# EAGLE design brmbora8 (EAGLE 6.2)
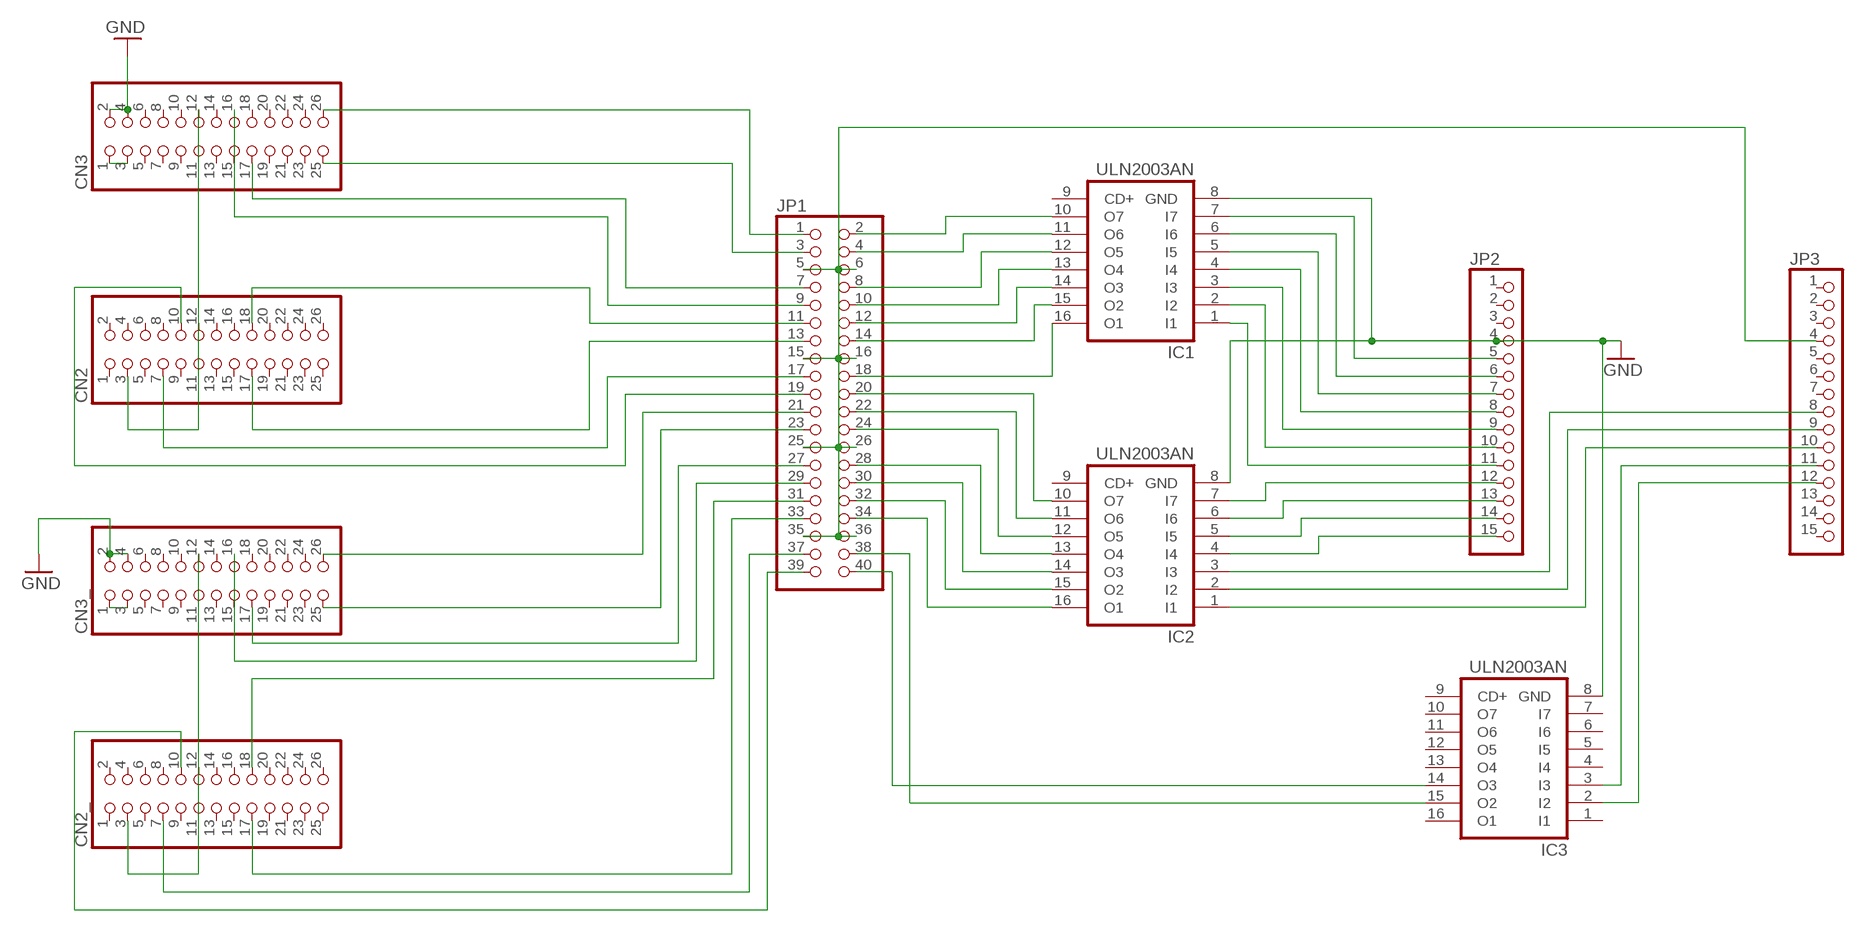
[diagram p0: schematic, sheet 1]

## Parts
CN2  PINHD-2X13  [2X13]
CN2_  PINHD-2X13  [2X13]
CN3  PINHD-2X13  [2X13]
CN3_  PINHD-2X13  [2X13]
IC1  ULN2003AN  [DIL16]
IC2  ULN2003AN  [DIL16]
IC3  ULN2003AN  [DIL16]
JP1  PINHD-2X20-BIG  [2X20-BIG]
JP2  PINHD-1X15  [1X15]
JP3  PINHD-1X15  [1X15]

## Nets
CN3_: CN3_.1 CN3_.3
GND: CN3.2 CN3.4 CN3_.2 CN3_.4 IC1.8(GND) IC2.8(GND) IC3.8(GND) JP2.4
N$1: IC1.13(O4) JP1.10
N$2: IC1.7(I7) JP2.5
N$3: IC1.6(I6) JP2.6
N$4: IC1.5(I5) JP2.7
N$5: IC1.4(I4) JP2.8
N$6: IC1.3(I3) JP2.9
N$7: IC1.2(I2) JP2.10
N$8: IC1.1(I1) JP2.11
N$9: IC2.7(I7) JP2.12
N$10: IC2.6(I6) JP2.13
N$11: IC2.5(I5) JP2.14
N$12: IC2.4(I4) JP2.15
N$13: IC2.1(I1) JP3.10
N$14: IC2.2(I2) JP3.9
N$15: IC2.3(I3) JP3.8
N$19: IC3.3(I3) JP3.11
N$20: IC3.2(I2) JP3.12
N$21: IC3.15(O2) JP1.38
N$22: IC3.14(O3) JP1.40
N$23: IC2.16(O1) JP1.34
N$24: IC2.15(O2) JP1.32
N$25: IC2.14(O3) JP1.30
N$26: IC2.13(O4) JP1.28
N$27: IC2.12(O5) JP1.24
N$28: IC2.11(O6) JP1.22
N$29: IC2.10(O7) JP1.20
N$30: JP1.5 JP1.6 JP1.15 JP1.16 JP1.25 JP1.26 JP1.35 JP1.36 JP3.4
N$31: IC1.16(O1) JP1.18
N$32: IC1.15(O2) JP1.14
N$33: IC1.14(O3) JP1.12
N$34: IC1.12(O5) JP1.8
N$35: IC1.11(O6) JP1.4
N$36: IC1.10(O7) JP1.2
N$37: CN3.1 CN3.3
N$38: CN2.3 CN2.11 CN3.12
N$39: CN3.26 JP1.1
N$40: CN2_.3 CN2_.11 CN3_.12
N$41: CN3.25 JP1.3
N$42: CN2.18 JP1.11
N$43: CN3.17 JP1.7
N$44: CN3.16 JP1.9
N$45: CN2.17 JP1.13
N$46: CN2.10 JP1.19
N$47: CN2.7 JP1.17
N$48: CN3_.26 JP1.21
N$49: CN3_.25 JP1.23
N$50: CN3_.16 JP1.29
N$51: CN3_.17 JP1.27
N$52: CN2_.18 JP1.31
N$53: CN2_.17 JP1.33
N$54: CN2_.10 JP1.39
N$55: CN2_.7 JP1.37
Unconnected: CN2.1 CN2.2 CN2.4 CN2.5 CN2.6 CN2.8 CN2.9 CN2.12 CN2.13 CN2.14 CN2.15 CN2.16 CN2.19 CN2.20 CN2.21 CN2.22 CN2.23 CN2.24 CN2.25 CN2.26 CN2_.1 CN2_.2 CN2_.4 CN2_.5 CN2_.6 CN2_.8 CN2_.9 CN2_.12 CN2_.13 CN2_.14 CN2_.15 CN2_.16 CN2_.19 CN2_.20 CN2_.21 CN2_.22 CN2_.23 CN2_.24 CN2_.25 CN2_.26 CN3.5 CN3.6 CN3.7 CN3.8 CN3.9 CN3.10 CN3.11 CN3.13 CN3.14 CN3.15 CN3.18 CN3.19 CN3.20 CN3.21 CN3.22 CN3.23 CN3.24 CN3_.5 CN3_.6 CN3_.7 CN3_.8 CN3_.9 CN3_.10 CN3_.11 CN3_.13 CN3_.14 CN3_.15 CN3_.18 CN3_.19 CN3_.20 CN3_.21 CN3_.22 CN3_.23 CN3_.24 IC1.9(CD+) IC2.9(CD+) IC3.1(I1) IC3.4(I4) IC3.5(I5) IC3.6(I6) IC3.7(I7) IC3.9(CD+) IC3.10(O7) IC3.11(O6) IC3.12(O5) IC3.13(O4) IC3.16(O1) JP2.1 JP2.2 JP2.3 JP3.1 JP3.2 JP3.3 JP3.5 JP3.6 JP3.7 JP3.13 JP3.14 JP3.15

## Library data of the parts
CN2 CN2_ CN3 CN3_ = pinhead:PINHD-2X13: PIN HEADER
IC1-IC3 = uln-udn:ULN2003A: DRIVER ARRAY
JP1 = adafruit:PINHD-2X20: PIN HEADER
JP2 JP3 = adafruit:PINHD-1X15: PIN HEADER

## Board
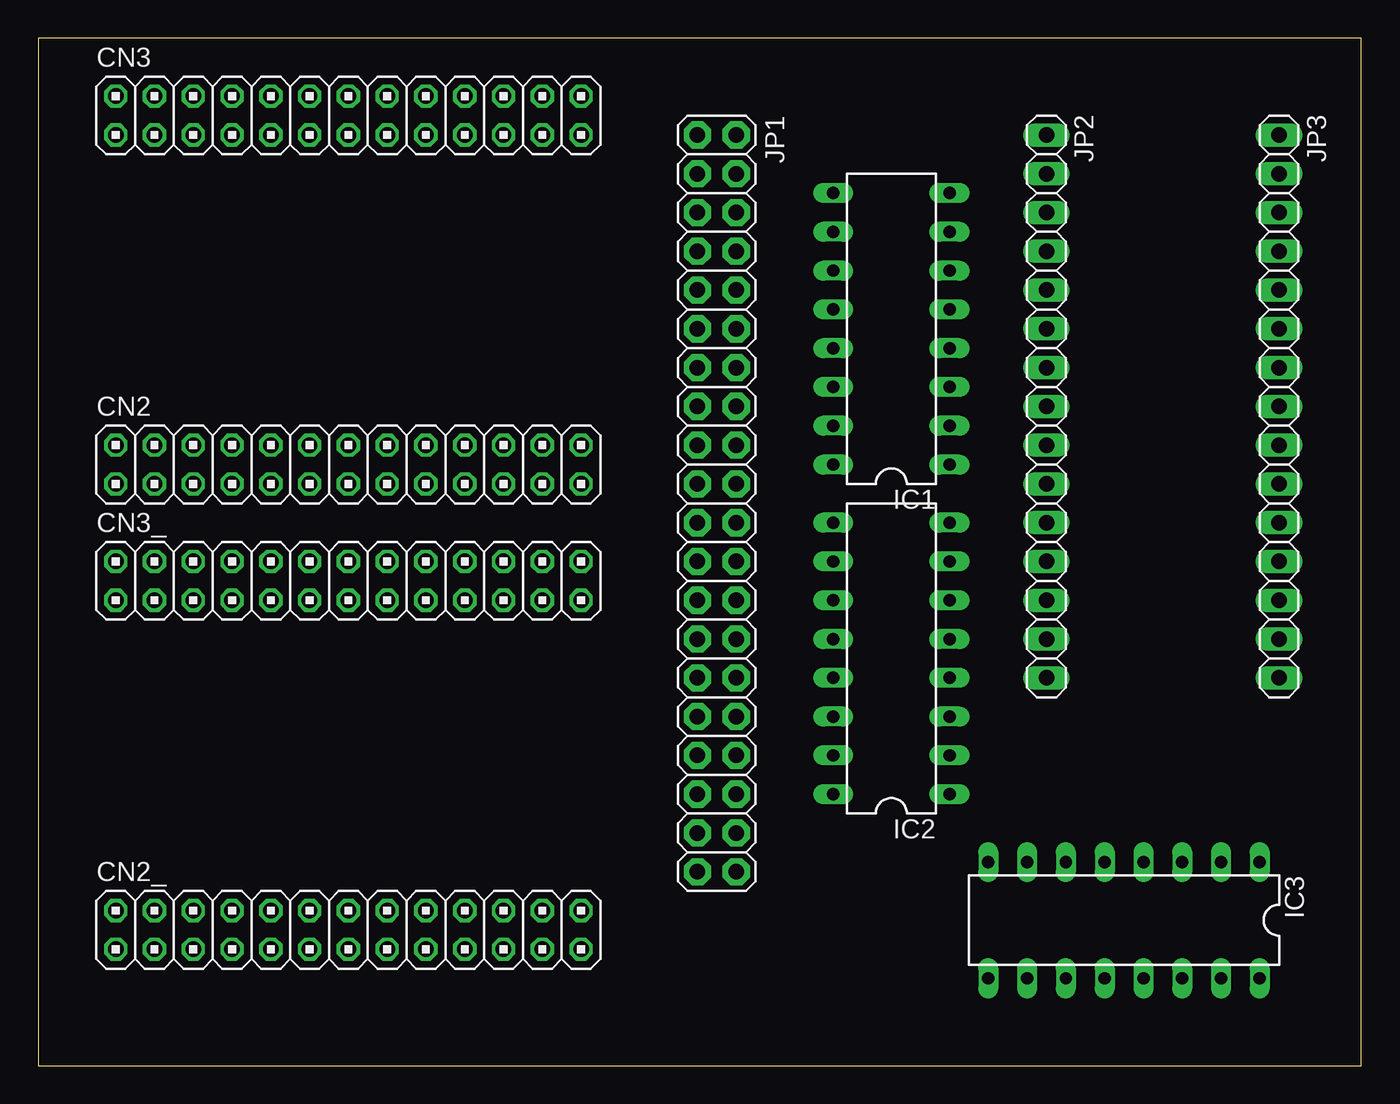
[diagram p1: board, top side]
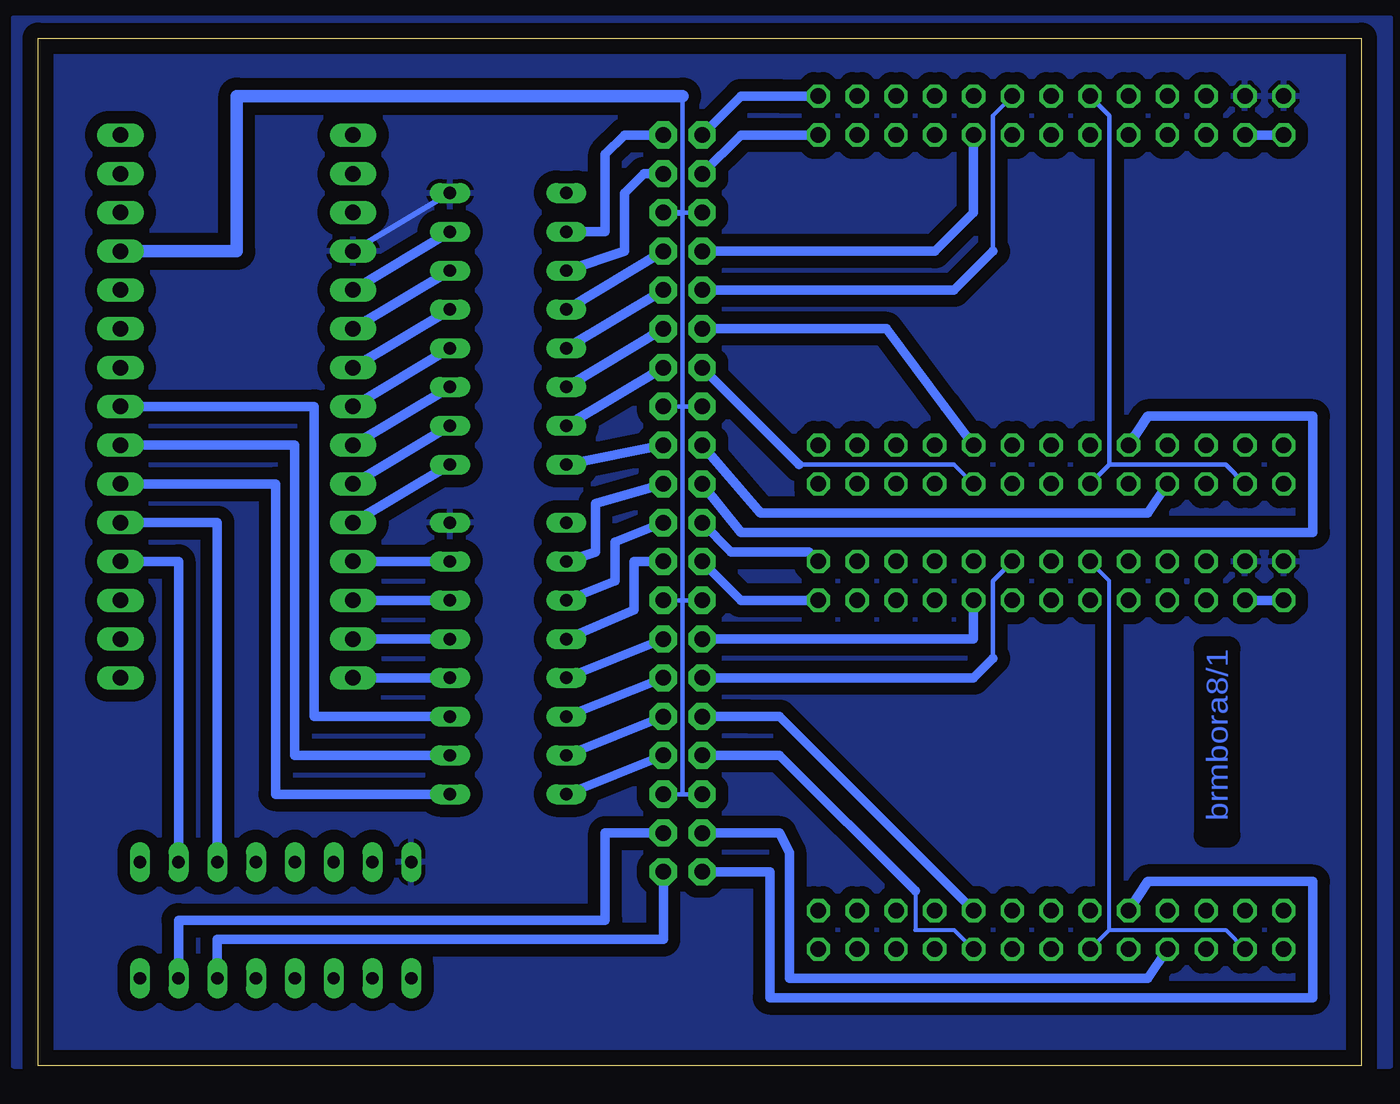
[diagram p2: board, bottom side, seen from below]

Size 86.67 x 67.3 mm. Coordinates in mm from the lower left corner, seen from the top.
Outline: 0,0 86.67,0 86.67,67.3 0,67.3 0,0
Copper layers (1*16): Top 0.035mm / dielectric 1.5mm / Bottom 0.035mm
Design rules: minimum track width 10mil, minimum drill 24mil, track to track 8mil, track to pad 8mil, pad to pad 8mil, via to via 8mil, smd to smd 8mil, copper to edge 40mil, drill to drill 8mil, minimum pad ring 10mil, minimum via ring 8mil, stop-mask expansion 4mil, vias tented up to drill 0mil, thermal gap 10mil

### Footprints (pad centres in the part's own frame; a part is rotated, then mirrored left to right if it is on the bottom)
2X13 = drill 1.016 octagon: 1 -15.24,-1.27; 2 -15.24,1.27; 3 -12.7,-1.27; 4 -12.7,1.27; 5 -10.16,-1.27; 6 -10.16,1.27; 7 -7.62,-1.27; 8 -7.62,1.27; 9 -5.08,-1.27; 10 -5.08,1.27; 11 -2.54,-1.27; 12 -2.54,1.27; 13 0,-1.27; 14 0,1.27; 15 2.54,-1.27; 16 2.54,1.27; 17 5.08,-1.27; 18 5.08,1.27; 19 7.62,-1.27; 20 7.62,1.27; 21 10.16,-1.27; 22 10.16,1.27; 23 12.7,-1.27; 24 12.7,1.27; 25 15.24,-1.27; 26 15.24,1.27
DIL16 = drill 0.813 long: 1 -8.89,-3.81; 2 -6.35,-3.81; 3 -3.81,-3.81; 4 -1.27,-3.81; 5 1.27,-3.81; 6 3.81,-3.81; 7 6.35,-3.81; 8 8.89,-3.81; 9 8.89,3.81; 10 6.35,3.81; 11 3.81,3.81; 12 1.27,3.81; 13 -1.27,3.81; 14 -3.81,3.81; 15 -6.35,3.81; 16 -8.89,3.81
2X20-BIG = drill 1.016 pad 1.778 octagon: 1 -24.13,-1.27; 2 -24.13,1.27; 3 -21.59,-1.27; 4 -21.59,1.27; 5 -19.05,-1.27; 6 -19.05,1.27; 7 -16.51,-1.27; 8 -16.51,1.27; 9 -13.97,-1.27; 10 -13.97,1.27; 11 -11.43,-1.27; 12 -11.43,1.27; 13 -8.89,-1.27; 14 -8.89,1.27; 15 -6.35,-1.27; 16 -6.35,1.27; 17 -3.81,-1.27; 18 -3.81,1.27; 19 -1.27,-1.27; 20 -1.27,1.27; 21 1.27,-1.27; 22 1.27,1.27; 23 3.81,-1.27; 24 3.81,1.27; 25 6.35,-1.27; 26 6.35,1.27; 27 8.89,-1.27; 28 8.89,1.27; 29 11.43,-1.27; 30 11.43,1.27; 31 13.97,-1.27; 32 13.97,1.27; 33 16.51,-1.27; 34 16.51,1.27; 35 19.05,-1.27; 36 19.05,1.27; 37 21.59,-1.27; 38 21.59,1.27; 39 24.13,-1.27; 40 24.13,1.27
1X15 = drill 1.016 long: 1 -17.78,0; 2 -15.24,0; 3 -12.7,0; 4 -10.16,0; 5 -7.62,0; 6 -5.08,0; 7 -2.54,0; 8 0,0; 9 2.54,0; 10 5.08,0; 11 7.62,0; 12 10.16,0; 13 12.7,0; 14 15.24,0; 15 17.78,0

### Placement (x,y rotation side)
CN2  20.32,39.37 0 top
CN2_  20.32,8.89 0 top
CN3  20.32,62.23 0 top
CN3_  20.32,31.75 0 top
IC1  55.88,48.26 90 top
IC2  55.88,26.67 90 top
IC3  71.12,9.52 180 top
JP1  44.45,36.83 270 top
JP2  66.04,43.18 270 top
JP3  81.28,43.18 270 top

### Tracks (layer width: path | path; a pad name or v marks a point on that pad's centre or on a via)
CN3_
  Bottom 0.61: CN3_.3 CN3_.1
GND
  Bottom 0.406: IC1.8 JP2.4
  pour Bottom (isolate 0.813, rank 6): -1.9,68.58 88.27,68.58 88.27,0 -1.9,0
N$1
  Bottom 0.61: IC1.13 JP1.10
N$2
  Bottom 0.61: JP2.5 IC1.7
N$3
  Bottom 0.61: JP2.6 IC1.6
N$4
  Bottom 0.61: JP2.7 IC1.5
N$5
  Bottom 0.61: JP2.8 IC1.4
N$6
  Bottom 0.61: JP2.9 IC1.3
N$7
  Bottom 0.61: JP2.10 IC1.2
N$8
  Bottom 0.61: JP2.11 IC1.1
N$9
  Bottom 0.61: JP2.12 IC2.7
N$10
  Bottom 0.61: JP2.13 IC2.6
N$11
  Bottom 0.61: JP2.14 IC2.5
N$12
  Bottom 0.61: JP2.15 IC2.4
N$13
  Bottom 0.61: JP3.10 71.12,38.1 71.12,17.78 IC2.1
N$14
  Bottom 0.61: JP3.9 69.85,40.64 69.85,20.32 IC2.2
N$15
  Bottom 0.61: JP3.8 68.58,43.18 68.58,22.86 IC2.3
N$19
  Bottom 0.61: JP3.11 74.93,35.56 IC3.3
N$20
  Bottom 0.61: JP3.12 77.47,33.02 IC3.2
N$21
  Bottom 0.61: JP1.38 49.53,15.24 49.53,9.52 77.47,9.52 IC3.15
N$22
  Bottom 0.61: JP1.40 45.72,8.25 74.93,8.25 IC3.14
N$23
  Bottom 0.61: IC2.16 JP1.34
N$24
  Bottom 0.61: IC2.15 JP1.32
N$25
  Bottom 0.61: IC2.14 JP1.30
N$26
  Bottom 0.61: IC2.13 JP1.28
N$27
  Bottom 0.61: IC2.12 47.62,29.85 47.62,33.02 JP1.24
N$28
  Bottom 0.61: IC2.11 48.89,31.75 48.89,34.29 JP1.22
N$29
  Bottom 0.61: IC2.10 50.17,33.66 50.17,36.83 JP1.20
N$30
  Bottom 0.305: 44.45,63.5 44.45,55.88 | 44.45,55.88 44.45,43.18 | 44.45,43.18 44.45,30.48 | 44.45,30.48 44.45,17.78 | JP1.5 44.45,55.88 | JP1.15 44.45,43.18 | JP1.25 44.45,30.48 | JP1.26 44.45,30.48 | JP1.16 44.45,43.18 | JP1.36 44.45,17.78 | JP1.35 44.45,17.78
  Bottom 0.406: JP1.6 44.45,55.88
  Bottom 0.813: JP3.4 73.66,53.34 73.66,63.5 44.45,63.5
N$31
  Bottom 0.61: IC1.16 JP1.18
N$32
  Bottom 0.61: IC1.15 JP1.14
N$33
  Bottom 0.61: IC1.14 JP1.12
N$34
  Bottom 0.61: IC1.12 JP1.8
N$35
  Bottom 0.61: IC1.11 48.26,53.34 48.26,57.15 46.99,58.42 JP1.4
N$36
  Bottom 0.61: IC1.10 49.53,54.61 49.53,59.69 48.26,60.96 JP1.2
N$37
  Bottom 0.61: CN3.3 CN3.1
N$38
  Bottom 0.305: CN2.3 8.89,39.37 16.51,39.37 | CN2.11 16.51,39.37 | CN3.12 16.51,62.23 16.51,39.37
N$39
  Bottom 0.61: CN3.26 38.1,63.5 40.64,63.5 JP1.1
N$40
  Bottom 0.254: CN2_.3 8.89,8.89 16.51,8.89 | CN2_.11 16.51,8.89 | CN3_.12 16.51,31.75 16.51,8.89
N$41
  Bottom 0.61: CN3.25 40.64,60.96 JP1.3
N$42
  Bottom 0.61: CN2.18 27.31,43.18 31.11,48.26 JP1.11
N$43
  Bottom 0.61: CN3.17 25.4,55.88 27.94,53.34 JP1.7
N$44
  Bottom 0.254: 24.13,62.23 CN3.16
  Bottom 0.305: 24.13,62.23 24.13,53.34
  Bottom 0.61: 24.13,53.34 26.67,50.8 JP1.9
N$45
  Bottom 0.254: 26.67,39.37 CN2.17
  Bottom 0.305: 36.83,39.37 26.67,39.37
  Bottom 0.61: 36.83,39.37 JP1.13
N$46
  Bottom 0.61: CN2.10 13.97,42.55 3.18,42.55 3.18,34.92 40.64,34.92 JP1.19
N$47
  Bottom 0.61: CN2.7 13.97,36.19 39.37,36.19 JP1.17
N$48
  Bottom 0.61: JP1.21 41.28,33.66 36.19,33.66 CN3_.26
N$49
  Bottom 0.61: CN3_.25 40.64,30.48 JP1.23
N$50
  Bottom 0.305: CN3_.16 24.13,31.75 24.13,26.67
  Bottom 0.61: 24.13,26.67 25.4,25.4 JP1.29
N$51
  Bottom 0.61: CN3_.17 25.4,27.94 JP1.27
N$52
  Bottom 0.61: CN2_.18 38.1,22.86 40,22.86 JP1.31
N$53
  Bottom 0.254: CN2_.17 26.67,8.89 29.21,8.89 29.21,11.43
  Bottom 0.61: 29.21,11.43 38.1,20.32 JP1.33
N$54
  Bottom 0.61: CN2_.10 13.97,12.07 3.18,12.07 3.18,4.45 38.73,4.45 38.73,12.7 JP1.39
N$55
  Bottom 0.61: CN2_.7 13.97,5.71 37.47,5.71 37.47,13.97 38.1,15.24 JP1.37

### Text on the board
Bottom: brmbora8/1